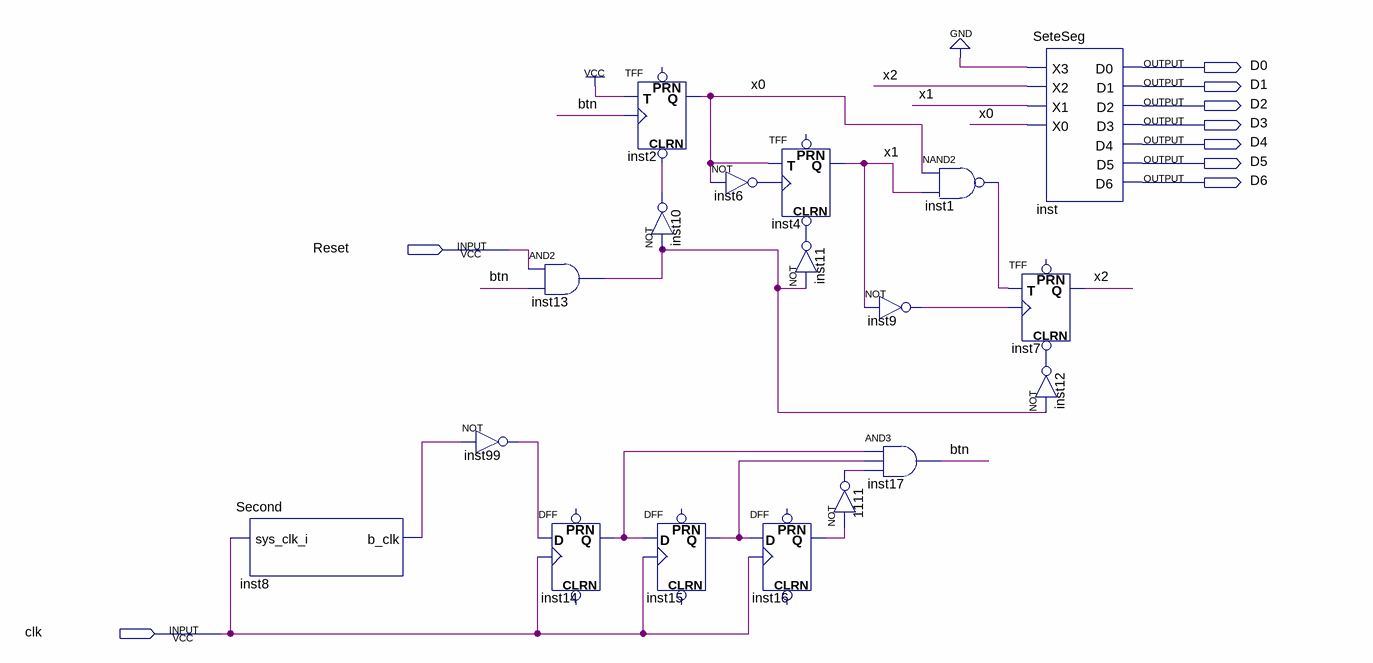
[diagram p0: schematic sheet]
// Quartus schematic Count.bdf as structural Verilog: 18 symbols, 9 pins
module Count (
  input  Reset,
  input  clk,
  output D0,
  output D1,
  output D2,
  output D3,
  output D4,
  output D5,
  output D6
);

  wire btn, inst1_out, inst6_out, inst8_b_clk, inst9_out, inst10_out, inst11_out, inst12_out, inst13_out,
       inst14_q, inst15_q, inst16_q, inst99_out, n1111_out, x0, x1, x2;

  Second inst8 (.sys_clk_i(clk), .b_clk(inst8_b_clk));
  not inst99 (inst99_out, inst8_b_clk);
  and inst13 (inst13_out, Reset, btn);
  DFF inst14 (.CLK(clk), .D(inst99_out), .Q(inst14_q));  // open: CLRN, PRN
  TFF inst2 (.CLRN(inst10_out), .T(1'b1), .CLK(btn), .Q(x0));  // open: PRN
  not inst10 (inst10_out, inst13_out);
  DFF inst15 (.CLK(clk), .D(inst14_q), .Q(inst15_q));  // open: CLRN, PRN
  not inst6 (inst6_out, x0);
  DFF inst16 (.CLK(clk), .D(inst15_q), .Q(inst16_q));  // open: CLRN, PRN
  TFF inst4 (.CLRN(inst11_out), .T(x0), .CLK(inst6_out), .Q(x1));  // open: PRN
  not inst11 (inst11_out, inst13_out);
  not u_1111 (n1111_out, inst16_q);
  not inst9 (inst9_out, x1);
  and inst17 (btn, inst14_q, inst15_q, n1111_out);
  nand inst1 (inst1_out, x0, x1);
  SeteSeg inst (.X3(1'b0), .X2(x2), .X1(x1), .X0(x0), .D0(D0), .D1(D1), .D2(D2), .D3(D3), .D4(D4), .D5(D5), .D6(D6));
  TFF inst7 (.CLRN(inst12_out), .T(inst1_out), .CLK(inst9_out), .Q(x2));  // open: PRN
  not inst12 (inst12_out, inst13_out);
endmodule
